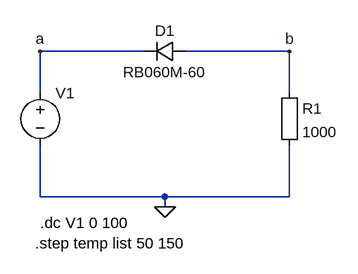
[diagram p0: schematic VA-R2.asc]
VA-R2.asc, the LTspice schematic file:
Version 4
SHEET 1 880 680
WIRE 16 128 -144 128
WIRE 240 128 80 128
WIRE -144 192 -144 128
WIRE 240 192 240 128
WIRE -144 352 -144 272
WIRE 48 352 -144 352
WIRE 240 352 240 272
WIRE 240 352 48 352
WIRE 48 368 48 352
FLAG -144 128 a
FLAG 240 128 b
FLAG 48 368 0
SYMBOL diode 80 112 R90
WINDOW 0 0 32 VBottom 2
WINDOW 3 32 32 VTop 2
SYMATTR InstName D1
SYMATTR Value RB060M-60
SYMBOL Misc\\EuropeanResistor 224 176 R0
SYMATTR InstName R1
SYMATTR Value 1000
SYMBOL voltage -144 176 R0
WINDOW 3 24 96 Invisible 2
WINDOW 123 0 0 Left 2
WINDOW 39 0 0 Left 2
SYMATTR Value ""
SYMATTR InstName V1
TEXT -144 392 Left 2 !.dc V1 0 100
TEXT -152 424 Left 2 !.step temp list 50 150

The netlist it stands for:
* VA-R2.asc
D1 b a RB060M-60
R1 b 0 1000
V1 a 0
.model D D
.lib standard.dio
.dc V1 0 100
.step temp list 50 150
.backanno
.end